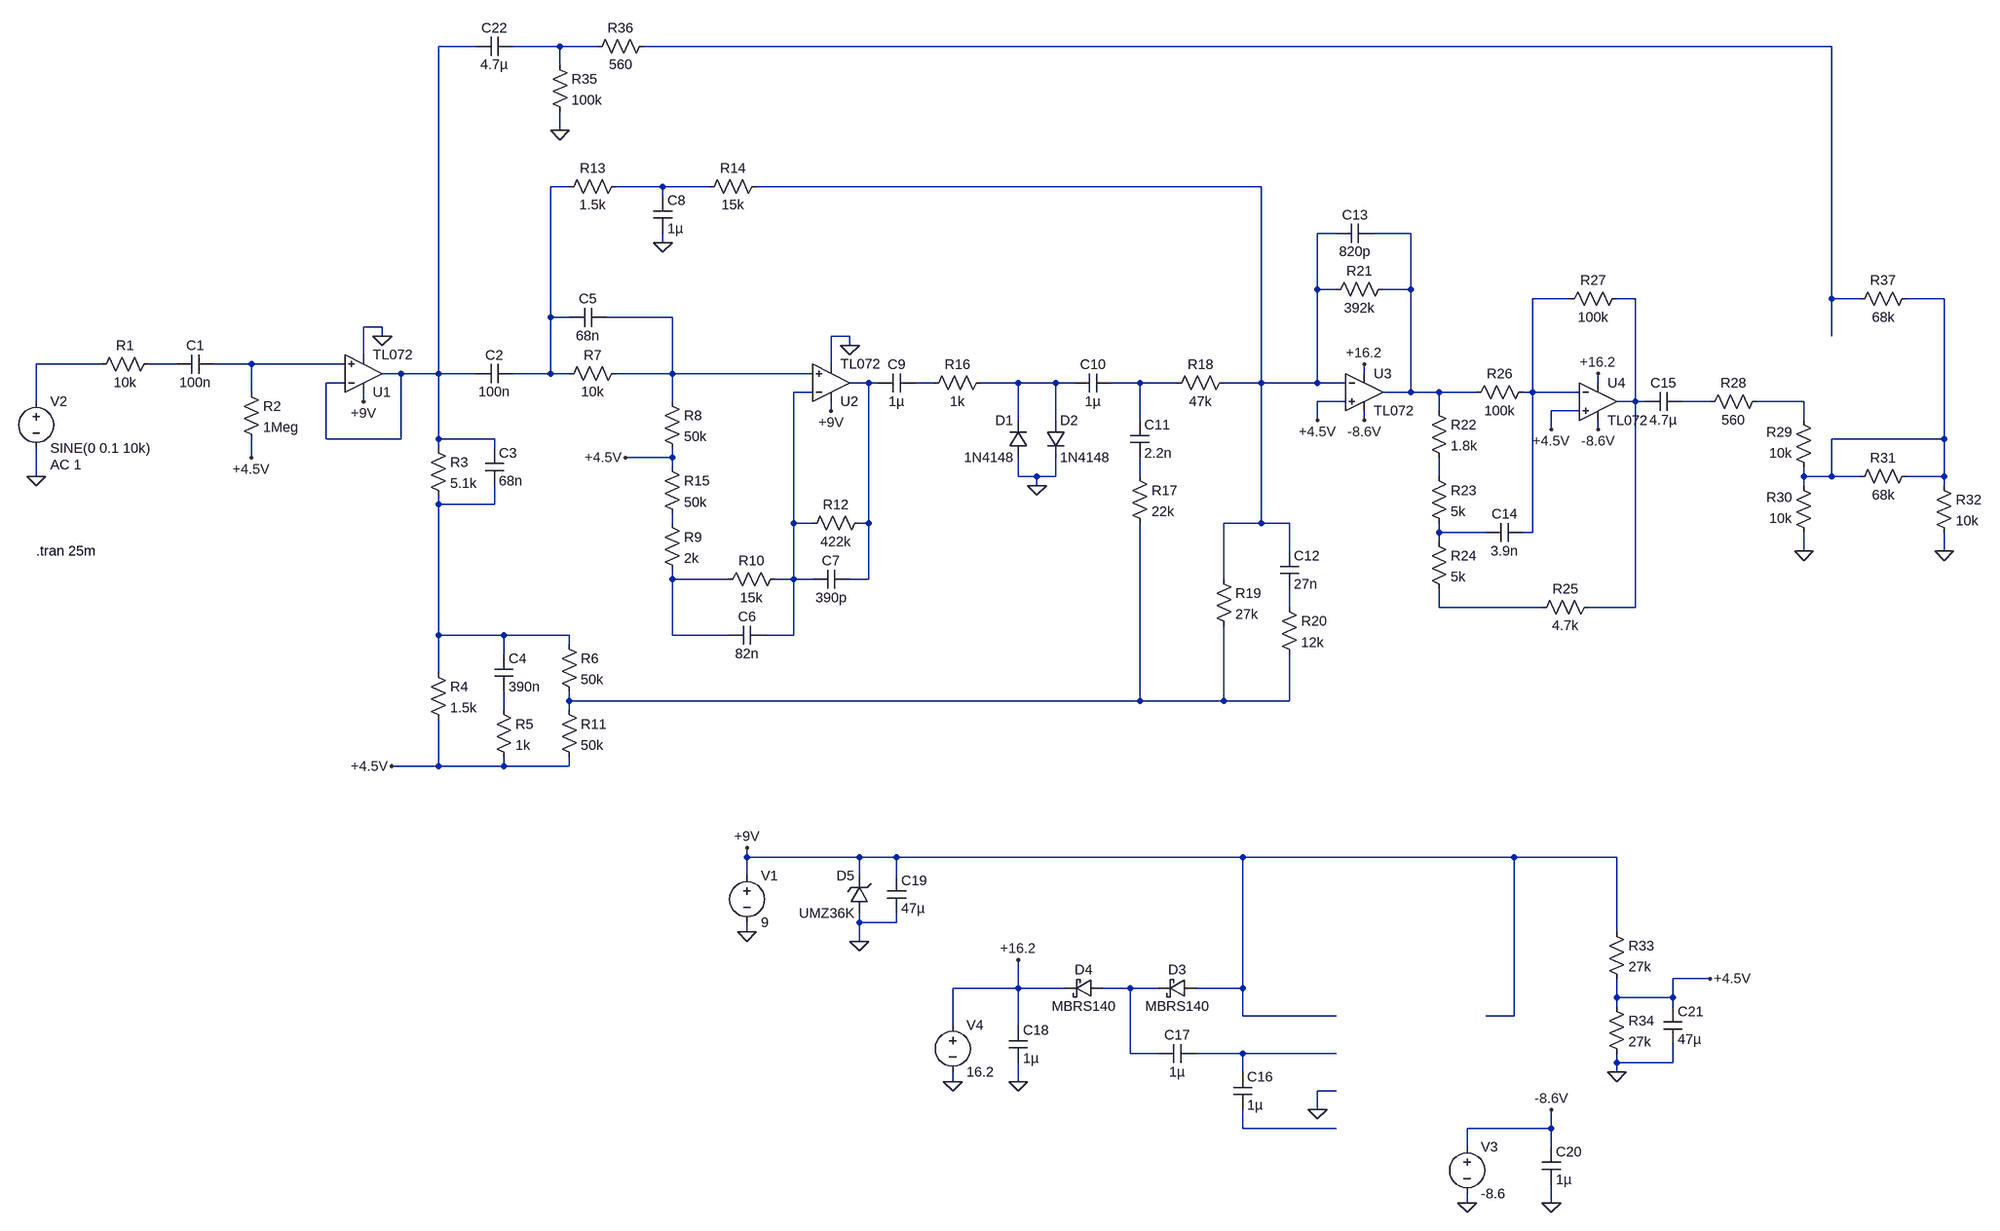
[diagram p0: schematic klon_clone.asc]
klon_clone.asc, the LTspice schematic file:
Version 4
SHEET 1 3268 2008
WIRE 688 -416 624 -416
WIRE 832 -416 752 -416
WIRE 896 -416 832 -416
WIRE 3008 -416 976 -416
WIRE 832 -384 832 -416
WIRE 832 -272 832 -304
WIRE 848 -176 816 -176
WIRE 1008 -176 928 -176
WIRE 1088 -176 1008 -176
WIRE 2032 -176 1168 -176
WIRE 1008 -160 1008 -176
WIRE 2160 -96 2128 -96
WIRE 2288 -96 2224 -96
WIRE 1008 -80 1008 -96
WIRE 2128 0 2128 -96
WIRE 2160 0 2128 0
WIRE 2288 0 2288 -96
WIRE 2288 0 2240 0
WIRE 2560 16 2496 16
WIRE 2672 16 2640 16
WIRE 3008 16 3008 -416
WIRE 3056 16 3008 16
WIRE 3200 16 3136 16
WIRE 816 48 816 -176
WIRE 848 48 816 48
WIRE 1024 48 912 48
WIRE 528 64 496 64
WIRE 528 80 528 64
WIRE 1328 80 1296 80
WIRE 3008 80 3008 16
WIRE 1328 96 1328 80
WIRE 496 112 496 64
WIRE 48 128 -64 128
WIRE 176 128 128 128
WIRE 304 128 240 128
WIRE 464 128 304 128
WIRE 1296 128 1296 80
WIRE 560 144 528 144
WIRE 624 144 624 -416
WIRE 624 144 560 144
WIRE 688 144 624 144
WIRE 816 144 816 48
WIRE 816 144 752 144
WIRE 848 144 816 144
WIRE 1024 144 1024 48
WIRE 1024 144 928 144
WIRE 1264 144 1024 144
WIRE 2208 144 2208 128
WIRE 464 160 432 160
WIRE 1360 160 1328 160
WIRE 1376 160 1360 160
WIRE 1472 160 1440 160
WIRE 1616 160 1552 160
WIRE 1680 160 1616 160
WIRE 1712 160 1680 160
WIRE 1824 160 1776 160
WIRE 1888 160 1824 160
WIRE 2032 160 2032 -176
WIRE 2032 160 1968 160
WIRE 2128 160 2128 0
WIRE 2128 160 2032 160
WIRE 2176 160 2128 160
WIRE 2608 160 2608 144
WIRE 304 176 304 128
WIRE 1264 176 1232 176
WIRE 2288 176 2288 0
WIRE 2288 176 2240 176
WIRE 2336 176 2288 176
WIRE 2400 176 2336 176
WIRE 2496 176 2496 16
WIRE 2496 176 2480 176
WIRE 2576 176 2496 176
WIRE -64 192 -64 128
WIRE 496 192 496 176
WIRE 1024 192 1024 144
WIRE 2176 192 2128 192
WIRE 2672 192 2672 16
WIRE 2672 192 2640 192
WIRE 2688 192 2672 192
WIRE 2800 192 2752 192
WIRE 2960 192 2880 192
WIRE 1296 208 1296 192
WIRE 2336 208 2336 176
WIRE 2576 208 2528 208
WIRE 1616 224 1616 160
WIRE 1680 224 1680 160
WIRE 1824 224 1824 160
WIRE 2128 224 2128 192
WIRE 2208 224 2208 208
WIRE 2960 224 2960 192
WIRE 2528 240 2528 208
WIRE 2608 240 2608 224
WIRE 432 256 432 160
WIRE 560 256 560 144
WIRE 560 256 432 256
WIRE 624 256 624 144
WIRE 720 256 624 256
WIRE 3200 256 3200 16
WIRE 3200 256 3008 256
WIRE 624 272 624 256
WIRE 720 272 720 256
WIRE 304 288 304 256
WIRE 1024 288 1024 272
WIRE 1024 288 944 288
WIRE 1024 304 1024 288
WIRE -64 320 -64 272
WIRE 1616 320 1616 288
WIRE 1648 320 1616 320
WIRE 1680 320 1680 288
WIRE 1680 320 1648 320
WIRE 1824 320 1824 288
WIRE 2336 320 2336 288
WIRE 2960 320 2960 304
WIRE 3008 320 3008 256
WIRE 3008 320 2960 320
WIRE 3056 320 3008 320
WIRE 3200 320 3200 256
WIRE 3200 320 3136 320
WIRE 1648 336 1648 320
WIRE 2960 336 2960 320
WIRE 3200 336 3200 320
WIRE 624 368 624 352
WIRE 720 368 720 336
WIRE 720 368 624 368
WIRE 1024 400 1024 384
WIRE 1232 400 1232 176
WIRE 1264 400 1232 400
WIRE 1360 400 1360 160
WIRE 1360 400 1344 400
WIRE 2032 400 2032 160
WIRE 2032 400 1968 400
WIRE 2080 400 2032 400
WIRE 2336 416 2336 400
WIRE 2416 416 2336 416
WIRE 2496 416 2496 176
WIRE 2496 416 2480 416
WIRE 2336 432 2336 416
WIRE 2080 448 2080 400
WIRE 2960 448 2960 416
WIRE 3200 448 3200 416
WIRE 1024 496 1024 480
WIRE 1120 496 1024 496
WIRE 1232 496 1232 400
WIRE 1232 496 1200 496
WIRE 1264 496 1232 496
WIRE 1360 496 1360 400
WIRE 1360 496 1328 496
WIRE 1968 496 1968 400
WIRE 2080 544 2080 512
WIRE 2336 544 2336 512
WIRE 2512 544 2336 544
WIRE 2672 544 2672 192
WIRE 2672 544 2592 544
WIRE 624 592 624 368
WIRE 736 592 624 592
WIRE 848 592 736 592
WIRE 1024 592 1024 496
WIRE 1120 592 1024 592
WIRE 1232 592 1232 496
WIRE 1232 592 1184 592
WIRE 848 608 848 592
WIRE 736 624 736 592
WIRE 624 656 624 592
WIRE 848 704 848 688
WIRE 1824 704 1824 400
WIRE 1824 704 848 704
WIRE 1968 704 1968 576
WIRE 1968 704 1824 704
WIRE 2080 704 2080 624
WIRE 2080 704 1968 704
WIRE 736 720 736 688
WIRE 848 720 848 704
WIRE 624 816 624 736
WIRE 624 816 544 816
WIRE 736 816 736 800
WIRE 736 816 624 816
WIRE 848 816 848 800
WIRE 848 816 736 816
WIRE 1152 1040 1152 1024
WIRE 1344 1040 1152 1040
WIRE 1408 1040 1344 1040
WIRE 2000 1040 1408 1040
WIRE 2464 1040 2000 1040
WIRE 2640 1040 2464 1040
WIRE 1152 1072 1152 1040
WIRE 1344 1072 1344 1040
WIRE 1408 1072 1408 1040
WIRE 1344 1152 1344 1136
WIRE 1408 1152 1408 1136
WIRE 1408 1152 1344 1152
WIRE 1152 1168 1152 1152
WIRE 2640 1168 2640 1040
WIRE 1344 1184 1344 1152
WIRE 2800 1248 2736 1248
WIRE 1616 1264 1616 1216
WIRE 1616 1264 1504 1264
WIRE 1696 1264 1616 1264
WIRE 1808 1264 1760 1264
WIRE 1856 1264 1808 1264
WIRE 2000 1264 2000 1040
WIRE 2000 1264 1920 1264
WIRE 2640 1280 2640 1248
WIRE 2736 1280 2736 1248
WIRE 2736 1280 2640 1280
WIRE 2640 1296 2640 1280
WIRE 2736 1296 2736 1280
WIRE 2000 1312 2000 1264
WIRE 2160 1312 2000 1312
WIRE 2464 1312 2464 1040
WIRE 2464 1312 2416 1312
WIRE 1504 1328 1504 1264
WIRE 1616 1328 1616 1264
WIRE 1808 1376 1808 1264
WIRE 1856 1376 1808 1376
WIRE 2000 1376 1920 1376
WIRE 2160 1376 2000 1376
WIRE 2640 1392 2640 1376
WIRE 2736 1392 2736 1360
WIRE 2736 1392 2640 1392
WIRE 2000 1408 2000 1376
WIRE 2640 1408 2640 1392
WIRE 1504 1424 1504 1408
WIRE 1616 1424 1616 1392
WIRE 2160 1440 2128 1440
WIRE 2128 1472 2128 1440
WIRE 2000 1504 2000 1472
WIRE 2160 1504 2000 1504
WIRE 2528 1504 2528 1472
WIRE 2528 1504 2384 1504
WIRE 2384 1536 2384 1504
WIRE 2528 1536 2528 1504
WIRE 2384 1632 2384 1616
WIRE 2528 1632 2528 1600
FLAG 528 80 0
FLAG 496 192 +9V
FLAG 1296 208 +9V
FLAG 1328 96 0
FLAG 2208 128 +16.2
FLAG 2208 224 -8.6V
FLAG 544 816 +4.5V
FLAG 944 288 +4.5V
FLAG 304 288 +4.5V
FLAG 2128 224 +4.5V
FLAG 2608 144 +16.2
FLAG 2608 240 -8.6V
FLAG 2528 240 +4.5V
FLAG 2960 448 0
FLAG 3200 448 0
FLAG 2128 1472 0
FLAG 1616 1216 +16.2
FLAG 2528 1472 -8.6V
FLAG 2640 1408 0
FLAG 2528 1632 0
FLAG 1616 1424 0
FLAG 2800 1248 +4.5V
FLAG 1152 1168 0
FLAG 1152 1024 +9V
FLAG -64 320 0
FLAG 832 -272 0
FLAG 1008 -80 0
FLAG 1648 336 0
FLAG 1344 1184 0
FLAG 2384 1632 0
FLAG 1504 1424 0
SYMBOL res 144 112 R90
WINDOW 0 0 56 VBottom 2
WINDOW 3 32 56 VTop 2
SYMATTR InstName R1
SYMATTR Value 10k
SYMBOL cap 240 112 R90
WINDOW 0 0 32 VBottom 2
WINDOW 3 32 32 VTop 2
SYMATTR InstName C1
SYMATTR Value 100n
SYMBOL res 288 160 R0
SYMATTR InstName R2
SYMATTR Value 1Meg
SYMBOL custom\\TL072 496 208 M180
SYMATTR InstName U1
SYMBOL cap 752 128 R90
WINDOW 0 0 32 VBottom 2
WINDOW 3 32 32 VTop 2
SYMATTR InstName C2
SYMATTR Value 100n
SYMBOL res 608 256 R0
SYMATTR InstName R3
SYMATTR Value 5.1k
SYMBOL cap 704 272 R0
SYMATTR InstName C3
SYMATTR Value 68n
SYMBOL res 608 640 R0
SYMATTR InstName R4
SYMATTR Value 1.5k
SYMBOL cap 720 624 R0
SYMATTR InstName C4
SYMATTR Value 390n
SYMBOL res 720 704 R0
SYMATTR InstName R5
SYMATTR Value 1k
SYMBOL res 944 128 R90
WINDOW 0 0 56 VBottom 2
WINDOW 3 32 56 VTop 2
SYMATTR InstName R7
SYMATTR Value 10k
SYMBOL cap 848 64 R270
WINDOW 0 32 32 VTop 2
WINDOW 3 0 32 VBottom 2
SYMATTR InstName C5
SYMATTR Value 68n
SYMBOL res 1008 176 R0
SYMATTR InstName R8
SYMATTR Value 50k
SYMBOL res 1008 384 R0
SYMATTR InstName R9
SYMATTR Value 2k
SYMBOL res 1216 480 R90
WINDOW 0 0 56 VBottom 2
WINDOW 3 32 56 VTop 2
SYMATTR InstName R10
SYMATTR Value 15k
SYMBOL cap 1184 576 R90
WINDOW 0 0 32 VBottom 2
WINDOW 3 32 32 VTop 2
SYMATTR InstName C6
SYMATTR Value 82n
SYMBOL res 832 592 R0
SYMATTR InstName R6
SYMATTR Value 50k
SYMBOL res 832 704 R0
SYMATTR InstName R11
SYMATTR Value 50k
SYMBOL cap 1328 480 R90
WINDOW 0 0 32 VBottom 2
WINDOW 3 32 32 VTop 2
SYMATTR InstName C7
SYMATTR Value 390p
SYMBOL res 1360 384 R90
WINDOW 0 0 56 VBottom 2
WINDOW 3 32 56 VTop 2
SYMATTR InstName R12
SYMATTR Value 422k
SYMBOL res 944 -192 R90
WINDOW 0 0 56 VBottom 2
WINDOW 3 32 56 VTop 2
SYMATTR InstName R13
SYMATTR Value 1.5k
SYMBOL cap 992 -160 R0
SYMATTR InstName C8
SYMATTR Value 1µ
SYMBOL res 1184 -192 R90
WINDOW 0 0 56 VBottom 2
WINDOW 3 32 56 VTop 2
SYMATTR InstName R14
SYMATTR Value 15k
SYMBOL custom\\TL072 1296 224 M180
SYMATTR InstName U2
SYMBOL res 1008 288 R0
SYMATTR InstName R15
SYMATTR Value 50k
SYMBOL cap 1440 144 R90
WINDOW 0 0 32 VBottom 2
WINDOW 3 32 32 VTop 2
SYMATTR InstName C9
SYMATTR Value 1µ
SYMBOL res 1568 144 R90
WINDOW 0 0 56 VBottom 2
WINDOW 3 32 56 VTop 2
SYMATTR InstName R16
SYMATTR Value 1k
SYMBOL diode 1632 288 R180
WINDOW 0 24 64 Left 2
WINDOW 3 24 0 Left 2
SYMATTR InstName D1
SYMATTR Value 1N4148
SYMBOL diode 1664 224 R0
SYMATTR InstName D2
SYMATTR Value 1N4148
SYMBOL cap 1776 144 R90
WINDOW 0 0 32 VBottom 2
WINDOW 3 32 32 VTop 2
SYMATTR InstName C10
SYMATTR Value 1µ
SYMBOL cap 1808 224 R0
SYMATTR InstName C11
SYMATTR Value 2.2n
SYMBOL res 1808 304 R0
SYMATTR InstName R17
SYMATTR Value 22k
SYMBOL res 1984 144 R90
WINDOW 0 0 56 VBottom 2
WINDOW 3 32 56 VTop 2
SYMATTR InstName R18
SYMATTR Value 47k
SYMBOL res 1952 480 R0
SYMATTR InstName R19
SYMATTR Value 27k
SYMBOL res 2064 528 R0
SYMATTR InstName R20
SYMATTR Value 12k
SYMBOL cap 2064 448 R0
SYMATTR InstName C12
SYMATTR Value 27n
SYMBOL custom\\TL072 2208 112 R0
SYMATTR InstName U3
SYMBOL res 2256 -16 R90
WINDOW 0 0 56 VBottom 2
WINDOW 3 32 56 VTop 2
SYMATTR InstName R21
SYMATTR Value 392k
SYMBOL cap 2224 -112 R90
WINDOW 0 0 32 VBottom 2
WINDOW 3 32 32 VTop 2
SYMATTR InstName C13
SYMATTR Value 820p
SYMBOL res 2320 192 R0
SYMATTR InstName R22
SYMATTR Value 1.8k
SYMBOL res 2320 304 R0
SYMATTR InstName R23
SYMATTR Value 5k
SYMBOL res 2320 416 R0
SYMATTR InstName R24
SYMATTR Value 5k
SYMBOL res 2608 528 R90
WINDOW 0 0 56 VBottom 2
WINDOW 3 32 56 VTop 2
SYMATTR InstName R25
SYMATTR Value 4.7k
SYMBOL cap 2480 400 R90
WINDOW 0 0 32 VBottom 2
WINDOW 3 32 32 VTop 2
SYMATTR InstName C14
SYMATTR Value 3.9n
SYMBOL res 2496 160 R90
WINDOW 0 0 56 VBottom 2
WINDOW 3 32 56 VTop 2
SYMATTR InstName R26
SYMATTR Value 100k
SYMBOL custom\\TL072 2608 128 R0
SYMATTR InstName U4
SYMBOL res 2656 0 R90
WINDOW 0 0 56 VBottom 2
WINDOW 3 32 56 VTop 2
SYMATTR InstName R27
SYMATTR Value 100k
SYMBOL cap 2752 176 R90
WINDOW 0 0 32 VBottom 2
WINDOW 3 32 32 VTop 2
SYMATTR InstName C15
SYMATTR Value 4.7µ
SYMBOL res 2896 176 R90
WINDOW 0 0 56 VBottom 2
WINDOW 3 32 56 VTop 2
SYMATTR InstName R28
SYMATTR Value 560
SYMBOL res 2976 320 R180
WINDOW 0 36 76 Left 2
WINDOW 3 36 40 Left 2
SYMATTR InstName R29
SYMATTR Value 10k
SYMBOL res 2976 432 R180
WINDOW 0 36 76 Left 2
WINDOW 3 36 40 Left 2
SYMATTR InstName R30
SYMATTR Value 10k
SYMBOL res 3040 336 R270
WINDOW 0 32 56 VTop 2
WINDOW 3 0 56 VBottom 2
SYMATTR InstName R31
SYMATTR Value 68k
SYMBOL res 3184 320 R0
SYMATTR InstName R32
SYMATTR Value 10k
SYMBOL cap 1984 1408 R0
SYMATTR InstName C16
SYMATTR Value 1µ
SYMBOL cap 1920 1360 R90
WINDOW 0 0 32 VBottom 2
WINDOW 3 32 32 VTop 2
SYMATTR InstName C17
SYMATTR Value 1µ
SYMBOL schottky 1920 1248 R90
WINDOW 0 0 32 VBottom 2
WINDOW 3 32 32 VTop 2
SYMATTR InstName D3
SYMATTR Value MBRS140
SYMATTR Description Diode
SYMATTR Type diode
SYMBOL schottky 1760 1248 R90
WINDOW 0 0 32 VBottom 2
WINDOW 3 32 32 VTop 2
SYMATTR InstName D4
SYMATTR Value MBRS140
SYMATTR Description Diode
SYMATTR Type diode
SYMBOL cap 1600 1328 R0
SYMATTR InstName C18
SYMATTR Value 1µ
SYMBOL zener 1360 1136 R180
WINDOW 0 24 64 Left 2
WINDOW 3 24 0 Left 2
SYMATTR InstName D5
SYMATTR Value UMZ36K
SYMBOL cap 1392 1072 R0
SYMATTR InstName C19
SYMATTR Value 47µ
SYMBOL cap 2512 1536 R0
SYMATTR InstName C20
SYMATTR Value 1µ
SYMBOL res 2624 1152 R0
SYMATTR InstName R33
SYMATTR Value 27k
SYMBOL res 2624 1280 R0
SYMATTR InstName R34
SYMATTR Value 27k
SYMBOL cap 2720 1296 R0
SYMATTR InstName C21
SYMATTR Value 47µ
SYMBOL voltage 1152 1056 R0
WINDOW 123 0 0 Left 0
WINDOW 39 0 0 Left 0
SYMATTR InstName V1
SYMATTR Value 9
SYMBOL voltage -64 176 R0
WINDOW 123 24 124 Left 2
WINDOW 39 0 0 Left 0
SYMATTR Value2 AC 1
SYMATTR InstName V2
SYMATTR Value SINE(0 0.1 10k)
SYMBOL cap 752 -432 R90
WINDOW 0 0 32 VBottom 2
WINDOW 3 32 32 VTop 2
SYMATTR InstName C22
SYMATTR Value 4.7µ
SYMBOL res 816 -400 R0
SYMATTR InstName R35
SYMATTR Value 100k
SYMBOL res 992 -432 R90
WINDOW 0 0 56 VBottom 2
WINDOW 3 32 56 VTop 2
SYMATTR InstName R36
SYMATTR Value 560
SYMBOL res 3152 0 R90
WINDOW 0 0 56 VBottom 2
WINDOW 3 32 56 VTop 2
SYMATTR InstName R37
SYMATTR Value 68k
SYMBOL voltage 2384 1520 R0
WINDOW 123 0 0 Left 0
WINDOW 39 0 0 Left 0
SYMATTR InstName V3
SYMATTR Value -8.6
SYMBOL voltage 1504 1312 R0
WINDOW 123 0 0 Left 0
WINDOW 39 0 0 Left 0
SYMATTR InstName V4
SYMATTR Value 16.2
TEXT -64 448 Left 2 !.tran 25m

The netlist it stands for:
* klon_clone.asc
R1 N013 N012 10k
C1 N014 N013 100n
R2 N014 +4.5V 1Meg
* U1: TL072 (symbol custom\TL072 not available, pins judged from their places): In+=N014 In-=N001 V+=+9V V-=0 OUT=N001
C2 N004 N001 100n
R3 N001 N024 5.1k
C3 N001 N024 68n
R4 N024 +4.5V 1.5k
C4 N024 N031 390n
R5 N031 +4.5V 1k
R7 N011 N004 10k
C5 N004 N011 68n
R8 N011 +4.5V 50k
R9 N025 N027 2k
R10 N019 N027 15k
C6 N019 N027 82n
R6 N024 N030 50k
R11 N030 +4.5V 50k
C7 N015 N019 390p
R12 N015 N019 422k
R13 N005 N004 1.5k
C8 N005 0 1µ
R14 N006 N005 15k
* U2: TL072 (symbol custom\TL072 not available, pins judged from their places): In+=N011 In-=N019 V+=+9V V-=0 OUT=N015
R15 +4.5V N025 50k
C9 N016 N015 1µ
R16 N017 N016 1k
D1 0 N017 1N4148
D2 N017 0 1N4148
C10 N018 N017 1µ
C11 N018 N022 2.2n
R17 N022 N030 22k
R18 N006 N018 47k
R19 N006 N030 27k
R20 N028 N030 12k
C12 N006 N028 27n
* U3: TL072 (symbol custom\TL072 not available, pins judged from their places): In+=+4.5V In-=N006 V+=+16.2 V-=-8.6V OUT=N007
R21 N007 N006 392k
C13 N007 N006 820p
R22 N007 N023 1.8k
R23 N023 N026 5k
R24 N026 N029 5k
R25 N009 N029 4.7k
C14 N008 N026 3.9n
R26 N008 N007 100k
* U4: TL072 (symbol custom\TL072 not available, pins judged from their places): In+=+4.5V In-=N008 V+=+16.2 V-=-8.6V OUT=N009
R27 N009 N008 100k
C15 N020 N009 4.7µ
R28 N021 N020 560
R29 N010 N021 10k
R30 0 N010 10k
R31 N010 N010 68k
R32 N010 0 10k
C16 N033 N034 1µ
C17 N033 N032 1µ
D3 +9V N032 MBRS140
D4 N032 +16.2 MBRS140
C18 +16.2 0 1µ
D5 0 +9V UMZ36K
C19 +9V 0 47µ
C20 -8.6V 0 1µ
R33 +9V +4.5V 27k
R34 +4.5V 0 27k
C21 +4.5V 0 47µ
V1 +9V 0 9
V2 N012 0 SINE(0 0.1 10k) AC 1
C22 N002 N001 4.7µ
R35 N002 0 100k
R36 N003 N002 560
R37 N010 N003 68k
V3 -8.6V 0 -8.6
V4 +16.2 0 16.2
.model D D
.lib standard.dio
.tran 25m
.backanno
.end